# EAGLE design module (EAGLE 9.5.1)
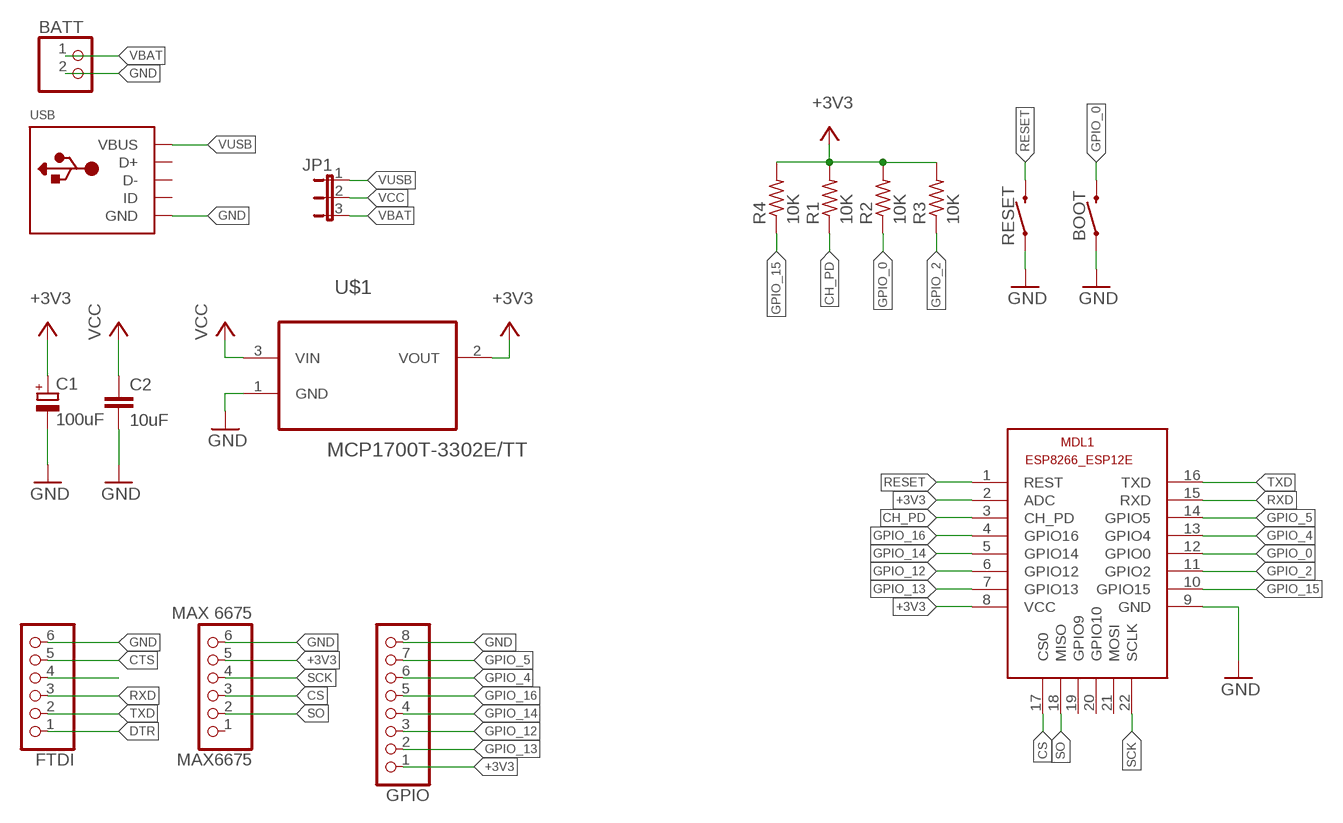
[diagram p0: schematic, sheet 1]

## Parts
BATT  PINHD-1X2  [1X02]
BOOT  gpio0  MOMENTARY-SWITCH-SPST-SMD-4.5MM  [TACTILE_SWITCH_SMD_4.5MM]
C1  100uF  CPOL-EU085CS-1AR  [085CS_1AR]
C2  10uF  C-EUC1206K  [C1206K]
FTDI  PINHD-1X6B  [1X06-BIG]
GPIO  PINHD-1X8BIG  [1X08-BIG]
JP1  JP2E  [JP2]
MAX6675  MAX 6675  PINHD-1X6B  [1X06-BIG]
MDL1  ESP8266-12EESP8266-ESP12E  [ESP8266-ESP12E]
R1  10K  R-US_M0805  [M0805]
R2  10K  R-US_M0805  [M0805]
R3  10K  R-US_M0805  [M0805]
R4  10K  R-US_M0805  [M0805]
RESET  reset  MOMENTARY-SWITCH-SPST-SMD-4.5MM  [TACTILE_SWITCH_SMD_4.5MM]
U$1  MCP1700T-3302E/TT  [SOT95P237X112-3N]
USB  USBMICRO_20329  [4UCONN_20329]

## Nets
+3V3 [3v3]: C1.+ GPIO.1 MAX6675.5 MDL1.2(ADC) MDL1.8(VCC) R1.2 R2.2 R3.2 R4.2 U$1.2(VOUT)
CH_PD [signal]: MDL1.3(CH_PD) R1.1
CS [signal]: MAX6675.3 MDL1.17(CS0)
CTS [signal]: FTDI.5
DTR [signal]: FTDI.1
GND: BATT.2 BOOT.2 BOOT.3 C1.- C2.2 FTDI.6 GPIO.8 MAX6675.6 MDL1.9(GND) RESET.2 RESET.3 U$1.1(GND) USB.BASE@1(GND) USB.BASE@2(GND) USB.GND USB.SPRT@1(GND) USB.SPRT@2(GND) USB.SPRT@3(GND) USB.SPRT@4(GND)
GPIO_0 [signal]: BOOT.1 BOOT.4 MDL1.12(GPIO0) R2.1
GPIO_2 [signal]: MDL1.11(GPIO2) R3.1
GPIO_4 [signal]: GPIO.6 MDL1.13(GPIO4)
GPIO_5 [signal]: GPIO.7 MDL1.14(GPIO5)
GPIO_12 [signal]: GPIO.3 MDL1.6(GPIO12)
GPIO_13 [signal]: GPIO.2 MDL1.7(GPIO13)
GPIO_14 [signal]: GPIO.4 MDL1.5(GPIO14)
GPIO_15: MDL1.10(GPIO15) R4.1
GPIO_16 [signal]: GPIO.5 MDL1.4(GPIO16)
N$5 [signal]: FTDI.4
RESET: MDL1.1(REST) RESET.1 RESET.4
RXD [signal]: FTDI.3 MDL1.15(RXD)
SCK [signal]: MAX6675.4 MDL1.22(SCLK)
SO [signal]: MAX6675.2 MDL1.18(MISO)
TXD [signal]: FTDI.2 MDL1.16(TXD)
VBAT [3v3]: BATT.1 JP1.3
VCC [3v3]: C2.1 JP1.2 U$1.3(VIN)
VUSB [3v3]: JP1.1 USB.VBUS
Unconnected: MAX6675.1 MDL1.19(GPIO9) MDL1.20(GPIO10) MDL1.21(MOSI) USB.D+ USB.D- USB.ID

## Library data of the parts
BATT = pinhead:PINHD-1X2: PIN HEADER
BOOT RESET = SparkFun-Switches:MOMENTARY-SWITCH-SPST: Momentary Switch (Pushbutton) - SPST Normally-open (NO) SPST momentary switches (buttons, pushbuttons). Variants PTH-12MM - 12mm square, through-hole Momentary Pushbutton Switch - 12mm Square <https://www.sparkfun.com/products/9190> (COM-09190) PTH-6.0MM, PTH-6.0MM-KIT - 6.0mm square, through-hole Mini Pushbutton Switch <https://www.sparkfun.com/products/97> (COM-00097) KIT package intended for soldering kit's - only one side of pads' copper is exposed. PTH-RIGHT-ANGLE-KIT - Right-angle, through-hole Right Angle Tactile Button <https://www.sparkfun.com/products/10791> - Used on SparkFun BigTime Watch Kit <https://www.sparkfun.com/products/11734> SMD-12MM - 12mm square, surface-mount Tactile Button - SMD (12mm) <https://www.sparkfun.com/products/12993> (COM-12993) Used on SparkFun PicoBoard <https://www.sparkfun.com/products/11888> SMD-4.5MM - 4.5mm Square Trackball Switch Used on SparkFun Blackberry Trackballer Breakout <https://www.sparkfun.com/products/13169> SMD-4.6MMX2.8MM - 4.60mm x 2.80mm, surface mount Used on SparkFun SAMD21 Mini Breakout <https://www.sparkfun.com/products/13664> SMD-5.2MM, SMD-5.2-REDUNDANT - 5.2mm square, surface-mount Mini Pushbutton Switch - SMD <https://www.sparkfun.com/products/8720> (COM-08720) Used on Arduino Pro Mini <https://www.sparkfun.com/products/11114> REDUNDANT package connects both switch circuits together SMD-6.0X3.5MM - 6.0 x 3.5mm, surface mount Momentary Reset Switch SMD <https://www.sparkfun.com/products/8229> (COM-08229) SMD-6.2MM-TALL - 6.2mm square, surface mount Tactile Button - SMD (6mm) <https://www.sparkfun.com/products/12992> Used on SparkFun Digital Sandbox <https://www.sparkfun.com/products/12651> SMD-RIGHT-ANGLE - Right-angle, surface mount Used on SparkFun Block for Intel® Edison - Arduino <https://www.sparkfun.com/products/13036>; PROD_ID: SWCH-09213
C1 = rcl:CPOL-EU: POLARIZED CAPACITOR, European symbol; SPICEPREFIX: C
C2 = rcl:C-EU: CAPACITOR, European symbol; SPICEPREFIX: C
FTDI MAX6675 = adafruit:PINHD-1X6: PIN HEADER
GPIO = adafruit:PINHD-1X8: PIN HEADER
JP1 = jumper:JP2E: JUMPER
MDL1 = esp12:ESP8266-12E: ESP8266-12E with additional I/O and GPIO04/05 corrected The author cannot warrant that this library is free from error or will meet your specific requirements. Created by PuceBaboon.com. Komagane, Nagano, JAPAN
R1-R4 = rcl:R-US_: RESISTOR, American symbol; SPICEPREFIX: R
U$1 = MCP1700T-3302E_TT:MCP1700T-3302E/TT: Low Quiescent Current LDO; AVAILABILITY: Unavailable; DESCRIPTION: Linear Voltage Regulator IC Positive Fixed 1 Output 250mA SOT-23-3; MF: Microchip; MP: MCP1700T-3302E/TT; PACKAGE: SOT-23-3 Microchip; PRICE: None
USB = Adafruit ESP8266 Feather rev E:USB: USB Connectors USBMINIB - Surface Mount Female Mini-B USB Connector 4UConnector: 06564

## Net classes
0 default: width 0.406 mm
1 signal: width 0.406 mm
2 3v3: width 0.508 mm

## Board
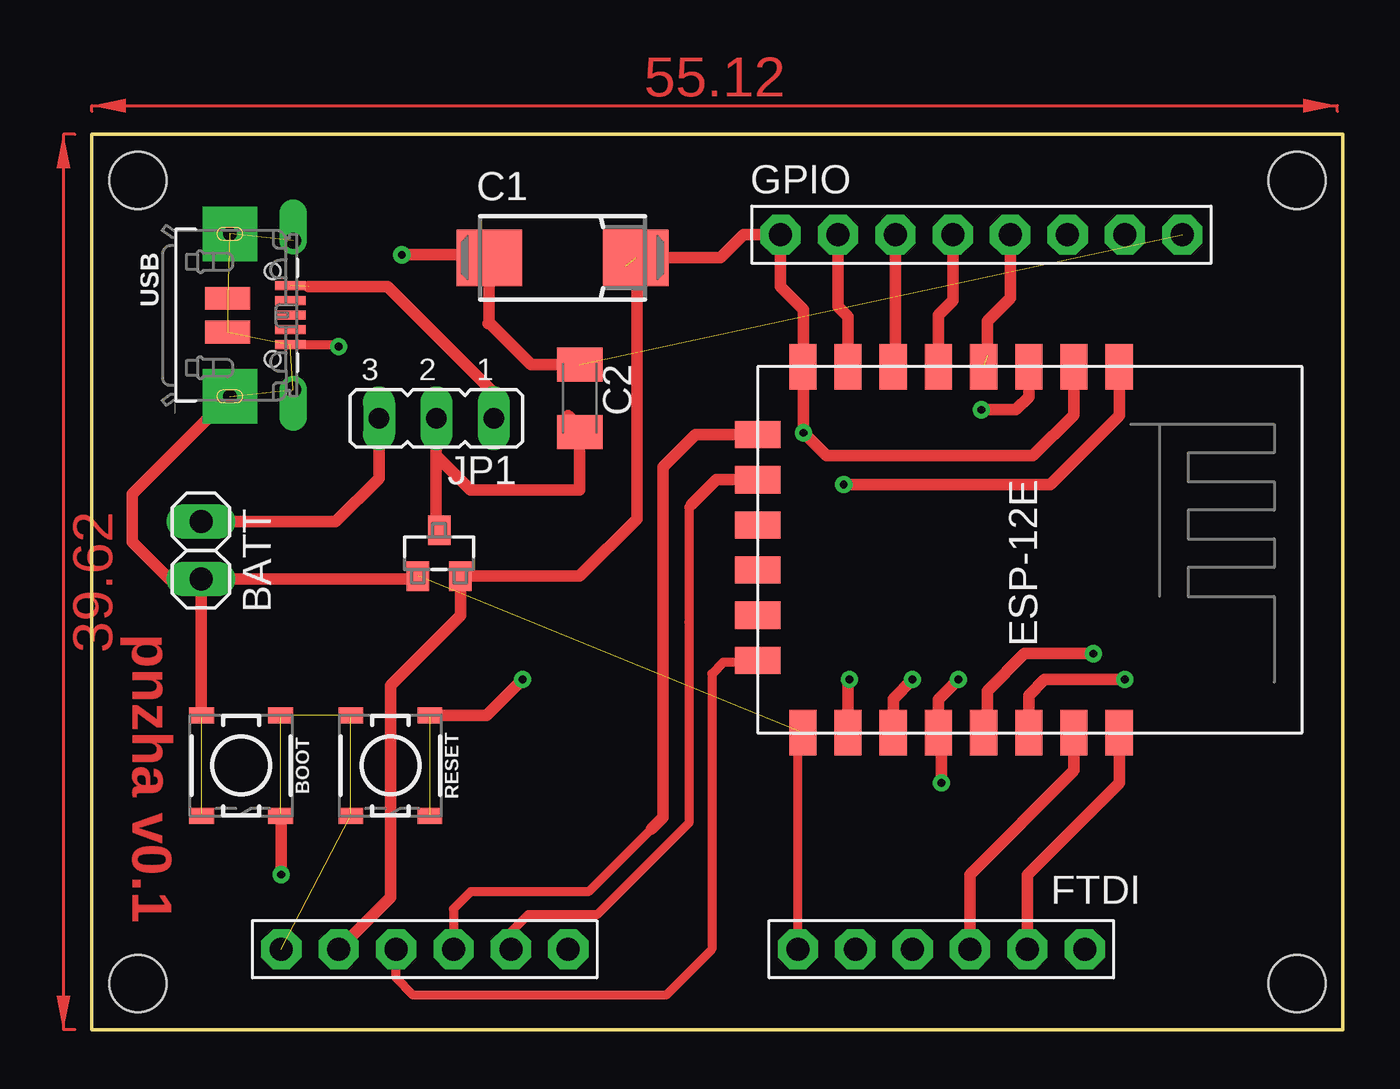
[diagram p1: board, top side]
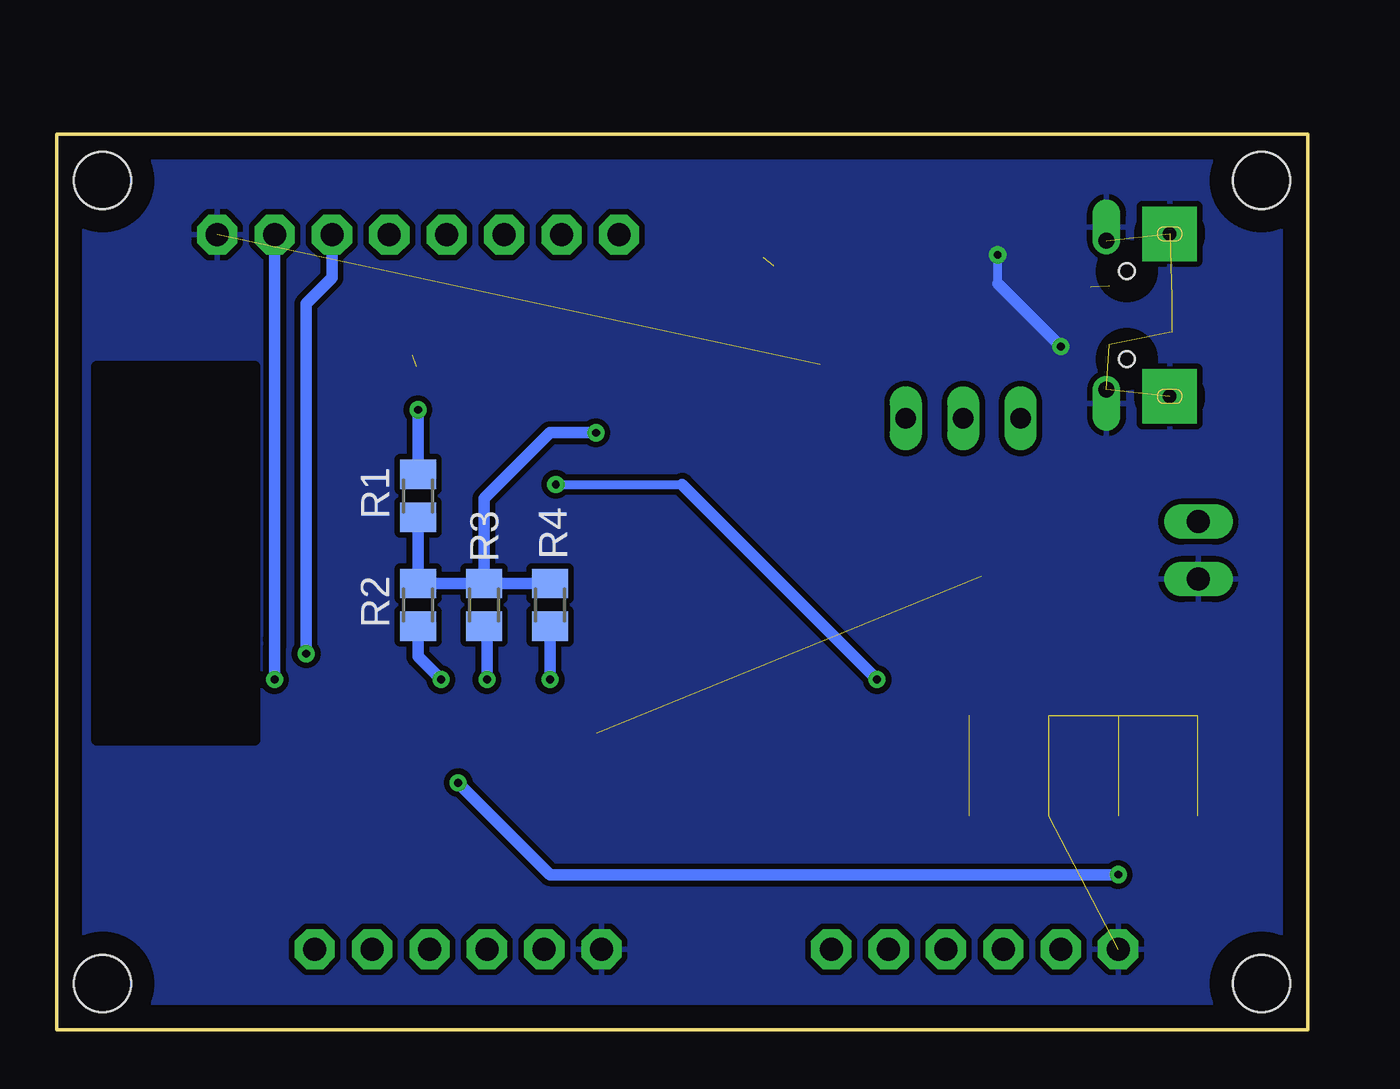
[diagram p2: board, bottom side, seen from below]

Size 55.37 x 39.62 mm. Coordinates in mm from the lower left corner, seen from the top.
Outline: 0,0 0,39.62 55.37,39.62 55.37,0 0,0
Copper layers (1*16): Top 0.035mm / dielectric 1.5mm / Bottom 0.035mm
Design rules "default": minimum track width 6mil, minimum drill 0.35mm, track to track 6mil, track to pad 6mil, pad to pad 6mil, via to via 6mil, smd to smd 6mil, copper to edge 40mil, drill to drill 6mil, minimum pad ring 10mil, minimum via ring 8mil, stop-mask expansion 4mil, vias tented up to drill 0mil, thermal gap 10mil
Holes 2.54 mm at 2.03,37.59 2.03,2.03 53.34,2.03 53.34,37.59

### Footprints (pad centres in the part's own frame; a part is rotated, then mirrored left to right if it is on the bottom)
1X02 = drill 1.016 long: 1 -1.27,0; 2 1.27,0
TACTILE_SWITCH_SMD_4.5MM = smd 0.7 x 1.1: 1 2.225,1.75; 2 2.225,-1.75; 3 -2.225,-1.75; 4 -2.225,1.75
085CS_1AR = smd 2.9 x 2.5: + 3.25,0; - -3.25,0
C1206K = smd 1.5 x 2: 1 -1.5,0; 2 1.5,0
1X06-BIG = drill 1.016 pad 1.778 octagon: 1 -6.35,0; 2 -3.81,0; 3 -1.27,0; 4 1.27,0; 5 3.81,0; 6 6.35,0
1X08-BIG = drill 1.016 pad 1.778 octagon: 1 -8.89,0; 2 -6.35,0; 3 -3.81,0; 4 -1.27,0; 5 1.27,0; 6 3.81,0; 7 6.35,0; 8 8.89,0
JP2 = drill 0.914 long: 1 -2.54,0; 2 0,0; 3 2.54,0
ESP8266-ESP12E = smd 2 x 1.2: 1 -7.62,5.84; 2 -7.62,3.84; 3 -7.62,1.84; 4 -7.62,-0.16; 5 -7.62,-2.16; 6 -7.62,-4.16; 7 -7.62,-6.16; 8 -7.62,-8.16; 9 8.58,-8.16; 10 8.58,-6.16; 11 8.58,-4.16; 12 8.58,-2.16; 13 8.58,-0.16; 14 8.58,1.84; 15 8.58,3.84; 16 8.58,5.84 | smd 1.2 x 2: 17 -4.62,-10.16; 18 -2.62,-10.16; 19 -0.62,-10.16; 20 1.38,-10.16; 21 3.38,-10.16; 22 5.38,-10.16
M0805 = smd 1.3 x 1.6: 1 -0.95,0; 2 0.95,0
SOT95P237X112-3N = smd 0.991 x 1.321: 1 -0.94,-1.016; 2 0.94,-1.016; 3 0,1.016
4UCONN_20329 = smd 1 x 2: BASE@1 -0.75,-2; BASE@2 0.75,-2 | smd 0.4 x 1.35: D+ 0,0.775; D- -0.65,0.775; GND 1.3,0.775; ID 0.65,0.775; VBUS -1.3,0.775 | drill 0.7 offset: SPRT@1 -3.3,0.9; SPRT@2 3.3,0.9 | drill 0.6 pad 2.413 square: SPRT@3 -3.6,-1.9; SPRT@4 3.6,-1.9 | hole 0.7: -1.95,0; 1.95,0

### Placement (x,y rotation side)
BATT  4.83,21.21 270 top
BOOT  6.6,11.68 270 top
C1  20.83,34.16 0 top
C2  21.59,27.94 90 top
FTDI  37.59,3.56 180 top
GPIO  39.37,35.18 0 top
JP1  15.24,27.05 180 top
MAX6675  14.73,3.56 180 top
MDL1  39.62,21.72 270 top
R1  39.37,23.62 270 bottom
R2  39.37,18.8 90 bottom
R3  36.45,18.8 90 bottom
R4  33.53,18.8 90 bottom
RESET  13.21,11.68 270 top
U$1  15.37,21.08 0 top
USB  8,31.62 270 top

### Tracks (layer width: path | path; a pad name or v marks a point on that pad's centre or on a via)
+3V3  (via drill 0.35)  (1 unrouted)
  Top 0.508: MDL1.8 31.5,29.37 31.5,31.88 30.48,32.89 GPIO.1 28.83,35.18 27.81,34.16 C1.+ 24.38,33.86 | MDL1.8 31.46,28.7 | 23.62,33.78 24.13,33.27 24.13,22.61 21.59,20.07 U$1.2 16.31,18.34 13.21,15.24 13.21,5.84 MAX6675.5 | MDL1.8 31.5,29.3 v31.5,26.42 32.51,25.4 41.66,25.4 43.46,27.21 MDL1.2
  Bottom 0.508: R3.2 36.45,23.49 33.53,26.42 v31.5,26.42 | R4.2 R3.2 | R3.2 R2.2 R1.2
CH_PD  (via drill 0.35)
  Top 0.508: MDL1.3 41.46,28 40.89,27.43 v39.37,27.43
  Bottom 0.508: v39.37,27.43 R1.1
CS
  Top 0.406: 24.77,8.89 21.97,6.1 16.76,6.1 16,5.33 MAX6675.3
  Top 0.508: 24.77,8.89 25.27,9.4 25.27,24.89 26.72,26.34 MDL1.17
GND  (via drill 0.35)  (12 unrouted)
  Top 0.406: MDL1.9 31.24,12.91 FTDI.6 | BOOT.3 4.83,13.94 | USB.GND 10.82,30.32 v10.92,30.23
  Top 0.508: BATT.2 14.3,19.94 U$1.1 | USB.SPRT@4 1.78,23.7 1.78,21.59 3.43,19.94 BATT.2 | 4.7,19.81 BATT.2 | 17.07,34.67 C1.- | C1.- 17.58,34.29 v13.72,34.29 | BATT.2 4.83,13.94 | 17.58,33.45 C1.- | C1.- 17.58,31.29 | 17.58,31.29 17.53,31.24 | C2.2 19.43,29.44 17.58,31.29
  Bottom 0.406: 13.72,33.02 v13.72,34.29
  Bottom 0.508: v10.92,30.23 13.72,33.02
  pour Bottom (isolate 0.254): 0.76,38.86 54.61,38.86 54.61,0.76 0.76,0.76
GPIO_0  (via drill 0.35)  (1 unrouted)
  Top 0.508: MDL1.12 | 8.38,13.94 BOOT.4 | MDL1.12 37.46,14.6 v38.35,15.49 | MDL1.12 37.59,13.01 v37.59,10.92 | v8.38,6.86 8.38,9.43 BOOT.1
  Bottom 0.508: 39.12,17.59 R2.1 39.37,16.51 v38.35,15.49 | v37.59,10.92 33.53,6.86 v8.38,6.86
GPIO_2  (via drill 0.35)
  Top 0.508: MDL1.11 35.46,14.64 v36.32,15.49
  Bottom 0.508: v36.32,15.49 36.32,17.72 R3.1
GPIO_4  (via drill 0.35)
  Top 0.508: MDL1.13 39.62,13.3 39.62,14.99 41.27,16.64 v44.32,16.64
  Bottom 0.508: v44.32,16.64 44.32,32.13 43.18,33.27 GPIO.6
GPIO_5  (via drill 0.35)
  Top 0.508: MDL1.14 41.46,14.79 42.16,15.49 v45.72,15.49
  Bottom 0.508: GPIO.7 45.72,17.27 45.72,16.89 v45.72,15.49
GPIO_12
  Top 0.508: MDL1.6 35.56,29.43 GPIO.3
GPIO_13
  Top 0.508: GPIO.2 33.02,32 33.46,31.56 MDL1.7
GPIO_14
  Top 0.508: GPIO.4 38.1,32.26 37.46,31.62 MDL1.5
GPIO_15  (via drill 0.35)
  Top 0.508: MDL1.10 33.46,15.49 v33.53,15.49
  Bottom 0.508: v33.53,15.49 R4.1
GPIO_16  (1 unrouted)
  Top 0.508: GPIO.5 40.64,32.38 39.62,31.37 39.62,29.84
RESET  (via drill 0.35)  (1 unrouted)
  Top 0.508: v19.05,15.49 17.46,13.91 RESET.4 | MDL1.1 45.46,27.18 42.42,24.13 v33.27,24.13
  Bottom 0.406: v33.27,24.13 27.69,24.13
  Bottom 0.508: 27.69,24.13 v19.05,15.49
RXD
  Top 0.508: 43.43,13.11 MDL1.15 43.46,11.46 38.86,6.86 FTDI.3
SCK
  Top 0.406: MDL1.22 29.38,16.26 27.94,16.26 27.43,15.75 27.43,3.56 25.4,1.52 14.22,1.52 13.46,2.29 MAX6675.4
SO
  Top 0.406: 26.54,23.24 26.42,23.11 26.42,18.03 26.42,9.14 22.35,5.08 19.3,5.08 18.54,4.32 MAX6675.2
  Top 0.508: 26.54,23.24 27.64,24.34 MDL1.18
TXD
  Top 0.508: MDL1.16 45.46,10.92 41.4,6.86 FTDI.2
VBAT
  Top 0.508: 12.7,26.67 JP1.3 12.7,24.38 10.8,22.48 BATT.1
VCC
  Top 0.508: 15.24,25.4 JP1.2 | 15.24,25.4 16.76,23.88 21.59,23.88 C2.1 21.59,26.67 21.08,27.18 | U$1.3 15.24,22.22 15.24,25.4
VUSB  (1 unrouted)
  Top 0.508: JP1.1 17.78,28.19 13.09,32.88 9.6,32.88
(copper drawn outside any net)
  shapes: Top area x2

### Text on the board
Top: pnzha v0.1